# EAGLE schematic 2.13in Tri-Color eInk with EYESPI (EAGLE 9.6.2)
COMPANY: ADAFRUIT INDUSTRIES; DRAWN: K. TOWNSEND; REV: A
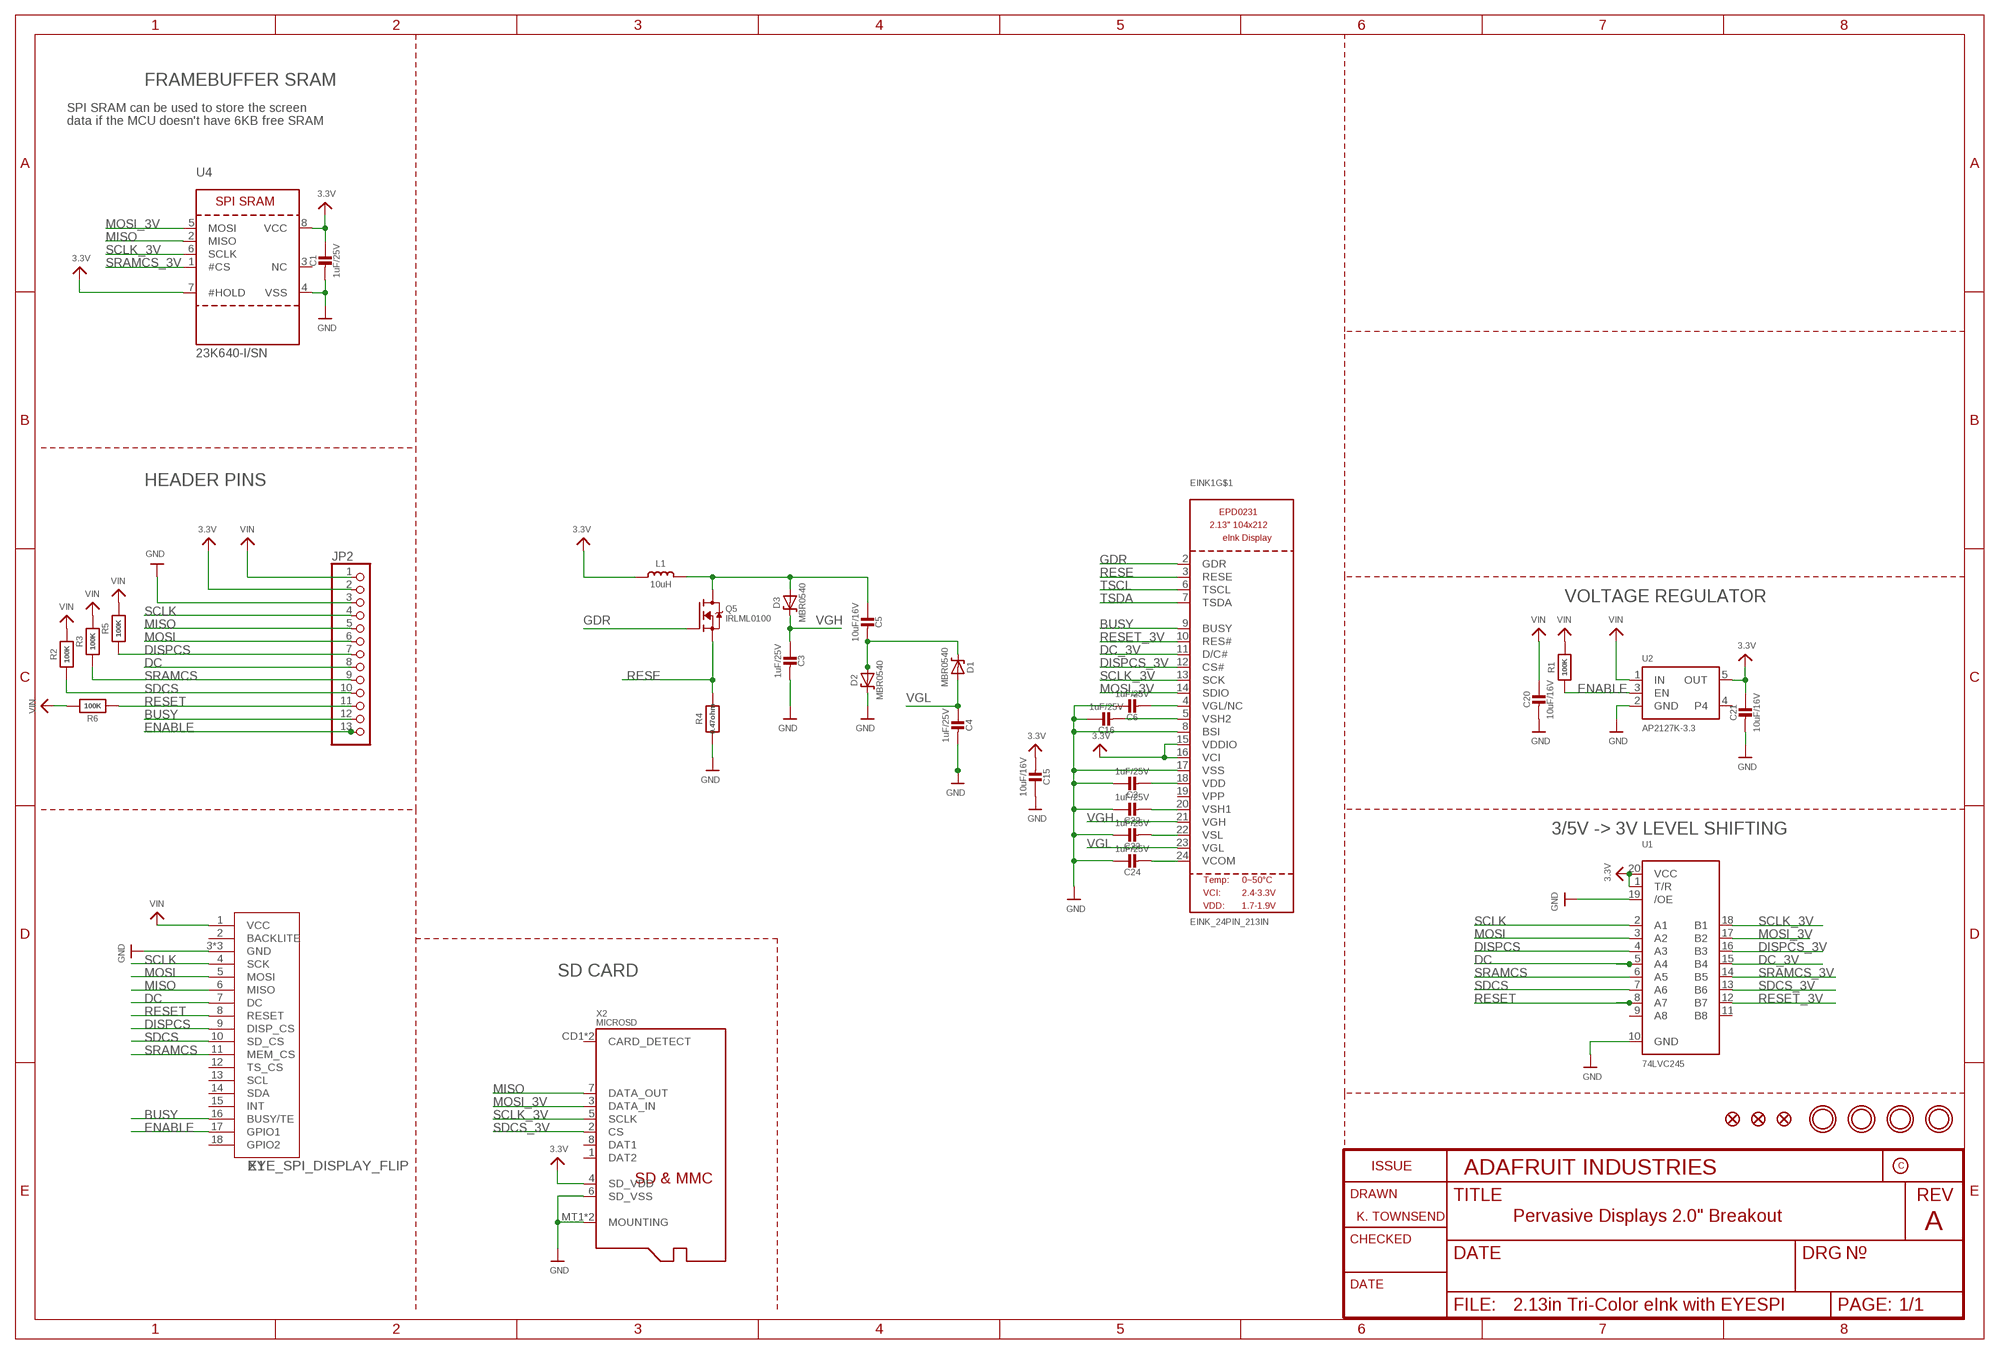
[diagram p0: schematic, sheet 1]

## Parts
C1  1uF/25V  CAP_CERAMIC0603_NO  [0603-NO]
C2  1uF/25V  CAP_CERAMIC0603_NO  [0603-NO]
C3  1uF/25V  CAP_CERAMIC0603_NO  [0603-NO]
C4  1uF/25V  CAP_CERAMIC0603_NO  [0603-NO]
C5  10uF/16V  CAP_CERAMIC0805-NOOUTLINE  [0805-NO]
C6  1uF/25V  CAP_CERAMIC0603_NO  [0603-NO]
C15  10uF/16V  CAP_CERAMIC0805-NOOUTLINE  [0805-NO]
C16  1uF/25V  CAP_CERAMIC0603_NO  [0603-NO]
C20  10uF/16V  CAP_CERAMIC0805-NOOUTLINE  [0805-NO]
C21  10uF/16V  CAP_CERAMIC0805-NOOUTLINE  [0805-NO]
C22  1uF/25V  CAP_CERAMIC0603_NO  [0603-NO]
C23  1uF/25V  CAP_CERAMIC0603_NO  [0603-NO]
C24  1uF/25V  CAP_CERAMIC0603_NO  [0603-NO]
D1  MBR0540  DIODE-SCHOTTKYSOD-123  [SOD-123]
D2  MBR0540  DIODE-SCHOTTKYSOD-123  [SOD-123]
D3  MBR0540  DIODE-SCHOTTKYSOD-123  [SOD-123]
EINK1  EINK_24PIN_213IN  [EINK_213IN_104X212]
FID1  FIDUCIAL_1MM  [FIDUCIAL_1MM]
FID2  FIDUCIAL_1MM  [FIDUCIAL_1MM]
FID3  FIDUCIAL_1MM  [FIDUCIAL_1MM]
JP2  HEADER-1X13  [1X13_ROUND_70]
L1  10uH  INDUCTORNR401  [INDUCTOR_4X4MM_NR401]
Q5  IRLML0100  IRLML2060TRPBF  [SOT23-3]
R1  100K  RESISTOR_0603_NOOUT  [0603-NO]
R2  100K  RESISTOR_0603_NOOUT  [0603-NO]
R3  100K  RESISTOR_0603_NOOUT  [0603-NO]
R4  0.47ohm  RESISTOR_0603_NOOUT  [0603-NO]
R5  100K  RESISTOR_0603_NOOUT  [0603-NO]
R6  100K  RESISTOR_0603_NOOUT  [0603-NO]
U1  74LVC245  74LCX245_TSSOP20  [TSSOP20]
U2  AP2127K-3.3  VREG_SOT23-5  [SOT23-5]
U4  23K640-I/SN  SRAM_SPI_SOIC8  [SOIC8_150MIL]
U$3  MOUNTINGHOLE2.5  [MOUNTINGHOLE_2.5_PLATED]
U$4  MOUNTINGHOLE2.5  [MOUNTINGHOLE_2.5_PLATED]
U$5  MOUNTINGHOLE2.5  [MOUNTINGHOLE_2.5_PLATED]
U$6  MOUNTINGHOLE2.5  [MOUNTINGHOLE_2.5_PLATED]
X1  EYE_SPI_DISPLAY_FLIP  [EYE_SPI_DISPLAY_BOTCONTACT]
X2  MICROSD  [MICROSD]

## Nets
3.3V: C1.1 C15.2 C21.1 EINK1.15(VDDIO) EINK1.16(VCI) JP2.2 L1.P$2 U1.1(T/R) U1.20(VCC) U2.5(OUT) U4.7(#HOLD) U4.8(VCC) X2.4(SD_VDD)
BUSY: EINK1.9(BUSY) JP2.12 X1.16(BUSY/TE)
DC: JP2.8 U1.5(A4) X1.7(DC)
DC_3V: EINK1.11(D/C#) U1.15(B4)
DISPCS: JP2.7 R5.1 U1.4(A3) X1.9(DISP_CS)
DISPCS_3V: EINK1.12(CS#) U1.16(B3)
ENABLE: JP2.13 R1.1 U2.3(EN) X1.17(GPIO1)
GDR: EINK1.2(GDR) Q5.1(G)
GND: C1.2 C2.1 C3.2 C4.2 C6.1 C15.1 C16.1 C20.2 C21.2 C22.1 C23.1 C24.1 D2.C EINK1.8(BSI) EINK1.17(VSS) JP2.3 R4.2 U1.10(GND) U1.19(/OE) U2.2(GND) U4.4(VSS) X1.3(GND) X1.SUPPORT1(GND) X1.SUPPORT2(GND) X2.6(SD_VSS) X2.MT1(MOUNTING) X2.MT2(MOUNTING)
MISO: JP2.5 U4.2(MISO) X1.6(MISO) X2.7(DATA_OUT)
MOSI: JP2.6 U1.3(A2) X1.5(MOSI)
MOSI_3V: EINK1.14(SDIO) U1.17(B2) U4.5(MOSI) X2.3(DATA_IN)
N$2: C5.2 D1.C D2.A
N$3: C5.1 D3.A L1.P$1 Q5.3(D)
N$4: C16.2 EINK1.5(VSH2)
N$5: C2.2 EINK1.18(VDD)
N$6: C22.2 EINK1.20(VSH1)
N$9: C6.2 EINK1.4(VGL/NC)
N$27: C23.2 EINK1.22(VSL)
N$33: C24.2 EINK1.24(VCOM)
RESE: EINK1.3(RESE) Q5.2(S) R4.1
RESET: JP2.11 R6.1 U1.8(A7) X1.8(RESET)
RESET_3V: EINK1.10(RES#) U1.12(B7)
SCLK: JP2.4 U1.2(A1) X1.4(SCK)
SCLK_3V: EINK1.13(SCK) U1.18(B1) U4.6(SCLK) X2.5(SCLK)
SDCS: JP2.10 R2.1 U1.7(A6) X1.10(SD_CS)
SDCS_3V: U1.13(B6) X2.2(CS)
SRAMCS: JP2.9 R3.1 U1.6(A5) X1.11(MEM_CS)
SRAMCS_3V: U1.14(B5) U4.1(#CS)
TSCL: EINK1.6(TSCL)
TSDA: EINK1.7(TSDA)
VGH: C3.1 D3.C EINK1.21(VGH)
VGL: C4.1 D1.A EINK1.23(VGL)
VIN: C20.1 JP2.1 R1.2 R2.2 R3.2 R5.2 R6.2 U2.1(IN) X1.1(VCC)
Unconnected: EINK1.19(VPP) EINK1.SPRT1(MT) EINK1.SPRT2(MT) U1.9(A8) U1.11(B8) U2.4 U4.3(NC) X1.2(BACKLITE) X1.12(TS_CS) X1.13(SCL) X1.14(SDA) X1.15(INT) X1.18(GPIO2) X2.1(DAT2) X2.8(DAT1) X2.CD1(CARD_DETECT) X2.CD2(CARD_DETECT)

## Notes on the sheet
- FRAMEBUFFER SRAM
- SPI SRAM can be used to store the screen
- data if the MCU doesn't have 6KB free SRAM
- HEADER PINS
- VOLTAGE REGULATOR
- 3/5V -> 3V LEVEL SHIFTING
- SD CARD
- Pervasive Displays 2.0" Breakout

## Library data of the parts
C1 = microbuilder:CAP_CERAMIC: Ceramic Capacitors For new designs, use the packages preceded by an '_' character since they are more reliable: The following footprints should be used on most boards: _0402 - Standard footprint for regular board layouts _0603 - Standard footprint for regular board layouts _0805 - Standard footprint for regular board layouts _1206 - Standard footprint for regular board layouts For extremely tight-pitch boards where space is at a premium, the following 'micro-pitch' footprints can be used (smaller pads, no silkscreen outline, etc.): _0402MP - Micro-pitch footprint for very dense/compact boards _0603MP - Micro-pitch footprint for very dense/compact boards _0805MP - Micro-pitch footprint for very dense/compact boards _1206MP - Micro-pitch footprint for very dense/compact boards; REV: D
C2-C6 C15 C16 C20-C24 = microbuilder:CAP_CERAMIC: Ceramic Capacitors For new designs, use the packages preceded by an '_' character since they are more reliable: The following footprints should be used on most boards: _0402 - Standard footprint for regular board layouts _0603 - Standard footprint for regular board layouts _0805 - Standard footprint for regular board layouts _1206 - Standard footprint for regular board layouts For extremely tight-pitch boards where space is at a premium, the following 'micro-pitch' footprints can be used (smaller pads, no silkscreen outline, etc.): _0402MP - Micro-pitch footprint for very dense/compact boards _0603MP - Micro-pitch footprint for very dense/compact boards _0805MP - Micro-pitch footprint for very dense/compact boards _1206MP - Micro-pitch footprint for very dense/compact boards
D1-D3 = microbuilder:DIODE-SCHOTTKY
EINK1 = adafruit_display:EINK_24PIN
FID1-FID3 = microbuilder:FIDUCIAL: Fiducial Alignment Points Various fiducial points for machine vision alignment.; BOM: EXCLUDE
JP2 = microbuilder:HEADER-1X13
L1 = microbuilder:INDUCTOR: Inductors 0603: 10nH Ceramic Inductor - microwire antenna/RF (Digikey: 712-1434-2-ND) 0805: 560nH Ceramic Inductor - RF (Digikey: 553-1047-1-ND) 270nH Ceramic Inductor - Q = 40@250MHz, +-5%, 1 Ohm DC Resistance (Digikey: 535-10506-2-ND) 1007 (2518 Metric) SMT: 10µH 10% 250mOhm 820mA 1007 Inductor (Digikey: 587-2189-1-ND) 22µH 10% 500mOhm 580mA 1007 Inductor (Digikey: 587-2190-1-ND) 47µH 10% 950mOhm 420mA 1007 Inductor (Digikey: 587-2191-1-ND) 47µH 5% 100mOhm 1A 1008 Inductor (Digikey: 732-1816-1-ND) 5.0x5.0mm (Taiyo Yuden NR5040 Series) 6.8µH 20% 2.3A 64mOhm Inductor (Digikey: 587-2374-2-ND) 5.0x5.0mm (TDK VLC5045 Series) 4.7µH 20% 3.3A 34mOhm Inductor (Digikey: 445-6526-1-ND) 6.8µH 20% 2.7A 46mOhm Inductor (Digikey: 445-6527-1-ND) 6.0x6.0mm (TDK VLC6045 Series) 4.7µH 20% 3.8A 27mOhm Inductor (Digikey: 445-6538-2-ND) 6.8µH 20% 3A 41mOhm Inductor (Digikey: 445-6540-1-ND) 6.2µH 30% 2.2A 45mOhm Inductor (Digikey: SRR5028-6R2YCT-ND) - Not TDK VLC6045 but footprint should match 6.0x6.0mm (TDK SLF6045 Series) 6.8uH 30% 2A 33mOhm Inductor (Digikey: 445-4572-1-ND, Mouser: 810-SLF645T6R8N2R0PF) 6.0x6.0mm (Sumida CDRH5D28 Series) 6.2uH 30% 1.8A 45mOhm Inductor (Digikey: 308-1542-1-ND) Taiyo Yuden NR3015T2R2M - 2.2uH 20% 1.5A (Digikey: 587-1648-2-ND, Mouser: 963-NR3015T2R2M) - Used with TI TPS62172 CoilCraft RFID Transponder Coil - MA5532-AE (For use with AS3935 Lightning Sensor) Taiyo Yuden NRH2412T2R2MNGH - 2.2uH 20% 1AA (Digikey: 587-3443-1-ND) - Used with TI LM3671 Vishay IHLP 1.0uH Molded Inductor - 24mOhm DCR, 5A, +/-20%, -55°C-125°C (Digikey: 541-1319-1-ND)
Q5 = Parts:IRLML2060TRPBF
R1-R6 = microbuilder:RESISTOR: Resistors For new designs, use the packages preceded by an '_' character since they are more reliable: The following footprints should be used on most boards: _0402 - Standard footprint for regular board layouts _0603 - Standard footprint for regular board layouts _0805 - Standard footprint for regular board layouts _1206 - Standard footprint for regular board layouts For extremely tight-pitch boards where space is at a premium, the following 'micro-pitch' footprints can be used (smaller pads, no silkscreen outline, etc.): _0402MP - Micro-pitch footprint for very dense/compact boards _0603MP - Micro-pitch footprint for very dense/compact boards _0805MP - Micro-pitch footprint for very dense/compact boards _1206MP - Micro-pitch footprint for very dense/compact boards
U1 = microbuilder:74LCX245: 74LCX245MTC - 5.0V Tolerant Bi-Directional Buffer Can be used to interface 5.0V logic to 2.5 or 3.3V devices Digikey: 74LCX245MTCXTR-ND Mouser: 512-74LCX245MTCX
U2 = adafruit_power:VREG_SOT23-5: SOT23-5 Fixed Voltage Regulators Part Current Out V Out V In V Dropout θJA (°C/W) TJ (°C) Digikey Part No. ADP121 150mA 3.3V 3.4-5.5V 0.09V @ 150mA -- -- ADP121-AUJZ33R7CT-ND ADP121 150mA 3.0V 3.1-5.5V 0.09V @ 150mA -- -- ADP121-AUJZ30R7CT-ND ADP122 300mA 3.3V 3.4-5.5V 0.085V @ 300mA -- -- ADP122AUJZ-3.3-R7CT-ND ADP1712 300mA 3.3V 3.5-5.5V 0.17V @ 300mA -- -- ADP1712AUJZ-3.3-R7TR-ND AP7311 (Low Cost) 150mA 3.3V 3.5-6V 0.15V @ 150mA -- -- AP7311-33WG-7DICT-ND LD39015M18R 150mA 1.8V 1.9V-5.5V 0.08V @ 100mA -- -- 497-6977-1-ND LP2985A-33DBVR 150mA 3.3V 3.3-16V 0.28V @ 150mA 206 150 296-18479-1-ND MCP1824T-3302E/OT 300mA 3.3V 3.5V-6V 0.2V @ 300mA -- -- MCP1824T-3302E/OTCT-ND MIC5205-2.5YM5 TR 150mA 2.5V 2.7-16V 0.165V @ 150mA -- -- 576-1257-2-ND MIC5205-3.0YM5 TR 150mA 3.0V 3.2V-16V 0.165V @ 150mA -- -- 576-1258-2-ND MIC5205-3.3YM5 TR 150mA 3.3V 3.5V-16V 0.165V @ 150mA -- -- 576-1259-2-ND TPS780330220 150mA 3.3V+2.2V 3.6-5.5V 250mV Max -- -- 296-23332-1-ND TDA3663/N1,135 100mA 3.3V 3.5-45V 0.18V @ 50mA -- -- 568-5343-1-ND Max operating temp can be calculated using θJA, TJ (max junction temperature), and power in watts. Set the "Maximum Ambient Temperature" until it reaches TJ ("Max Junction Temperature"), which is the absolute limit for safe use of the regulator: Heat Sink Temperature Calculator <http://www.daycounter.com/Calculators/Heat-Sink-Temperature-Calculator.phtml> For example, With 12V source into a 3.3V LP2985 and a 30mA load, we are dissipating (12V-3.3V) * 0.03A = 0.261W. With a θJA of 206 °C/W, a TJ of 150°C, and 261mW we can safely use the chip without a heat sink up to 75°C (=147.1°C Junction Temperature).; JLC_ROTATION: 0
U4 = microbuilder:SRAM_SPI_SOIC8: SRAM - 8-Pin SPI Interface 23K640-I/SN - 8KB (64Kb), 20MHz, 2.7-3.6V 23K256-I/SN - 32KB (256Kb), 20MHz, 2.7-3.6V 23LC512-I/SN - 64KB (512Kb), 20MHz, 2.7-3.6V
U$3-U$6 = adafruit_electromech:MOUNTINGHOLE: Mounting Hole For #2 screws (0.086"/2.18mm width, 0.094"/2.4mm hole) use 2.5mm; BOM: EXCLUDE
X1 = adafruit_display:EYE_SPI_DISPLAY; LCSC: C2856802
X2 = adafruit_electromech:MICROSD: MicroSD/Transflash Card Holder with SPI pinout 3M: 2908-05WB-MG 4UConnector: 19656 Footprint courtesy: Adafruit Industries; JLC_ROTATION: 90; LCSC: C125617